# Altium schematic sheet DSO_ADC.SchDoc: Schematic_Name
size A4; CompanyName: University of Melbourne; Engineer: Your Name Here; DocumentNumber: 1; Revision: 0.1; SheetNumber: 1; SheetTotal: 1; Title_Project: Project_Title; StudentNo: Student No.
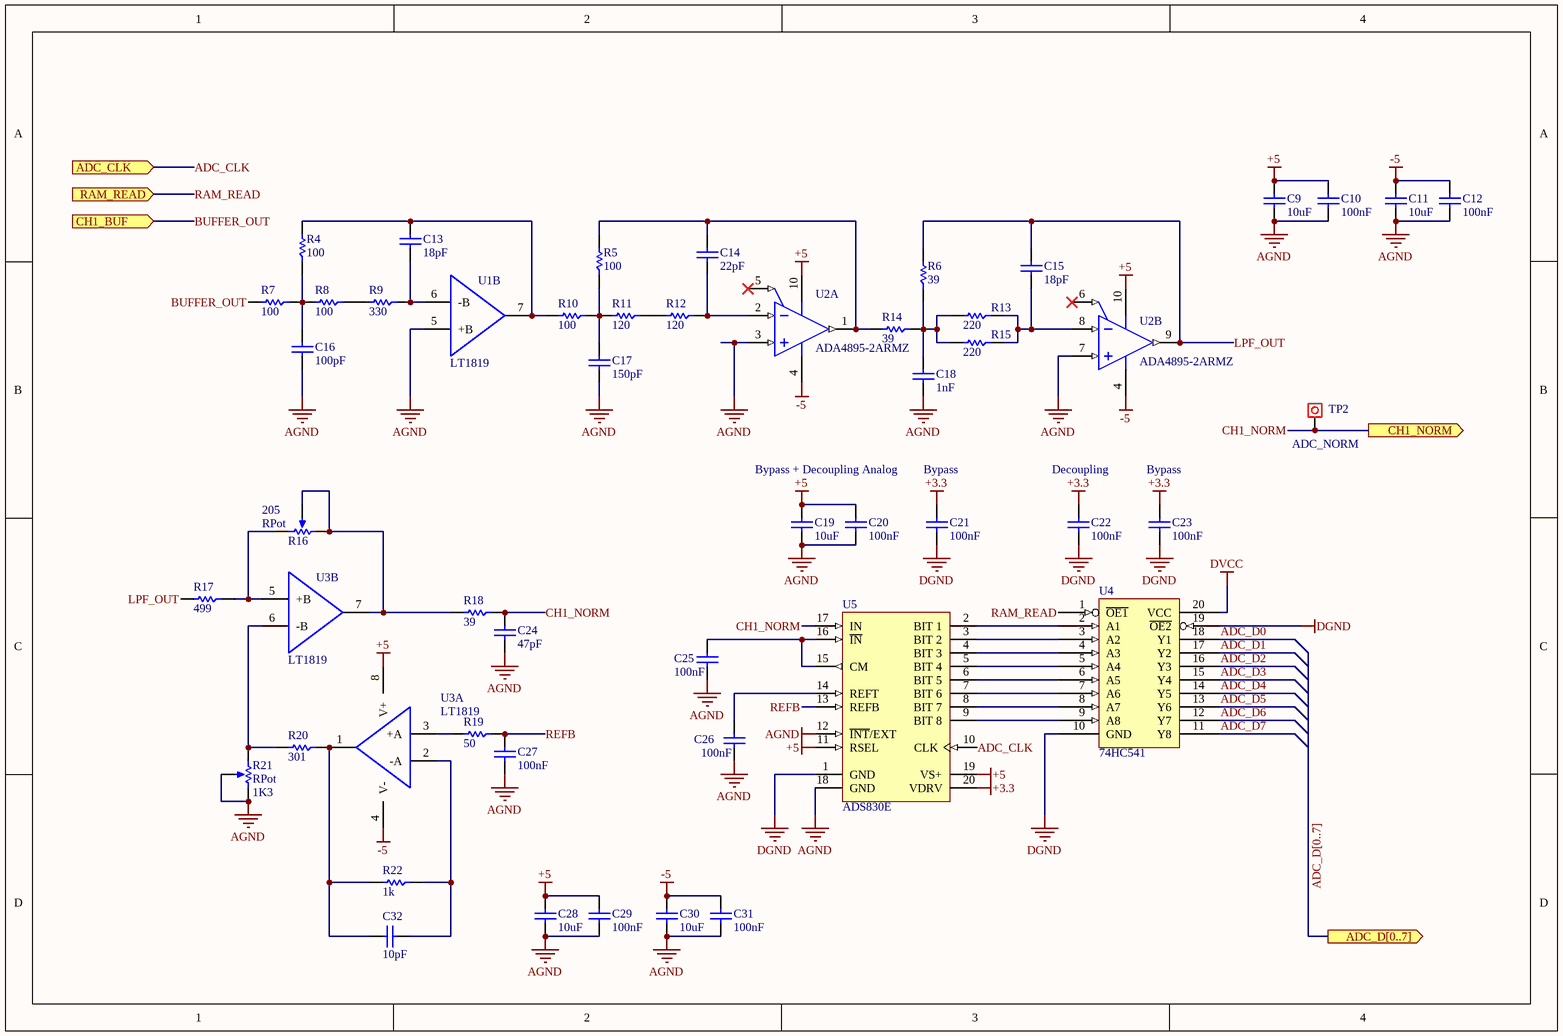
[diagram p0: DSO_ADC.SchDoc]

## Parts
C9  10uF  [0805C]
C10  100nF  [0805C]
C11  10uF  [0805C]
C12  100nF  [0805C]
C13  18pF  [0805C]
C14  22pF  [0805C]
C15  18pF  [0805C]
C16  100pF  [0805C]
C17  150pF  [0805C]
C18  1nF  [0805C]
C19  10uF  [0805C]
C20  100nF  [0805C]
C21  100nF  [0805C]
C22  100nF  [0805C]
C23  100nF  [0805C]
C24  47pF  [0805C]
C25  100nF  [0805C]
C26  100nF  [0805C]
C27  100nF  [0805C]
C28  10uF  [0805C]
C29  100nF  [0805C]
C30  10uF  [0805C]
C31  100nF  [0805C]
C32  10pF  [0805C]
R4  100  [0805]
R5  100  [0805]
R6  39  [0805]
R7  100  [0805]
R8  100  [0805]
R9  330  [0805]
R10  100  [0805]
R11  120  [0805]
R12  120  [0805]
R13  220  [0805]
R14  39  [0805]
R15  220  [0805]
R16  RPot  value 205  [VR5]
R17  499  [0805]
R18  39  [0805]
R19  50  [0805]
R20  301  [0805]
R21  RPot  value 1K3  [VR5]
R22  1k  [0805]
TP2  ADC_NORM  [Testpoin]  (no BOM)
U1  LT1819  [SOIC-8]  (part B of 2)
U2  ADA4895-2ARMZ  [ADI-RM-10_M]  (parts A,B of 2)
U3  LT1819  [SOIC-8]  (parts A,B of 2)
U4  74HC541  [SOT163-1_N]
U5  ADS830E  [TI-DBQ20_L]

## Ports
ADC_CLK (in), ADC_D[0..7] (out), CH1_BUF (in), CH1_NORM (out), RAM_READ (in)

## Nets
+3.3: C21.1 C22.1 C23.1 U5.20(VDRV)
+5: C9.1 C10.1 C19.1 C20.1 C28.1 C29.1 U2.10(+VS) U3.8(V+) U5.11(RSEL) U5.19(VS+)
-5: C11.1 C12.1 C30.1 C31.1 U2.4(-VS) U3.4(V-)
AGND: C9.2 C10.2 C11.2 C12.2 C16.2 C17.2 C18.2 C19.2 C20.2 C24.2 C25.2 C26.2 C27.2 C28.2 C29.2 C30.2 C31.2 R21.2(TAP) R21.3(BOT) U1.5(+B) U2.3(+IN_1) U2.7(+IN_2) U5.12(~{INT}/EXT) U5.18(GND)
DGND: C21.2 C22.2 C23.2 U4.10(GND) U4.19(~{OE2}) U5.1(GND)
DVCC: U4.20(VCC)
ADC_CLK: U5.10(CLK) ; port ADC_CLK
ADC_D0: U4.18(Y1)
ADC_D1: U4.17(Y2)
ADC_D2: U4.16(Y3)
ADC_D3: U4.15(Y4)
ADC_D4: U4.14(Y5)
ADC_D5: U4.13(Y6)
ADC_D6: U4.12(Y7)
ADC_D7: U4.11(Y8)
BUFFER_OUT: R7.2 ; port CH1_BUF
CH1_NORM: C24.1 R18.1 TP2.1 U5.17(IN) ; port CH1_NORM
LPF_OUT: C15.1 R6.2 R17.2 U2.9(OUT_2)
RAM_READ: U4.1(~{OE1}) ; port RAM_READ
REFB: C27.1 R19.1 U5.13(REFB)
NetC13_1: C13.1 R4.2 R10.2 U1.7(OUTB)
NetC13_2: C13.2 R9.1 U1.6(-B)
NetC14_1: C14.1 R5.2 R14.2 U2.1(OUT_1)
NetC14_2: C14.2 R12.1 U2.2(-IN_1)
NetC15_2: C15.2 R13.1 R15.1 U2.8(-IN_2)
NetC16_1: C16.1 R4.1 R7.1 R8.2
NetC17_1: C17.1 R5.1 R10.1 R11.2
NetC18_1: C18.1 R6.1 R13.2 R14.1 R15.2
NetC25_1: C25.1 U5.15(CM) U5.16(~{IN})
NetC26_1: C26.1 U5.14(REFT)
NetC32_1: C32.1 R20.1 R22.2 U3.1(OUTA)
NetC32_2: C32.2 R22.1 U3.2(-A)
NetR8_1: R8.1 R9.2
NetR11_1: R11.1 R12.2
NetR16_1: R16.1(TOP) R16.2(TAP) R18.2 U3.7(OUTB)
NetR16_3: R16.3(BOT) R17.1 U3.5(+B)
NetR19_2: R19.2 U3.3(+A)
NetR20_2: R20.2 R21.1(TOP) U3.6(-B)
NetU4_2: U4.2(A1) U5.2(BIT_1)
NetU4_3: U4.3(A2) U5.3(BIT_2)
NetU4_4: U4.4(A3) U5.4(BIT_3)
NetU4_5: U4.5(A4) U5.5(BIT_4)
NetU4_6: U4.6(A5) U5.6(BIT_5)
NetU4_7: U4.7(A6) U5.7(BIT_6)
NetU4_8: U4.8(A7) U5.8(BIT_7)
NetU4_9: U4.9(A8) U5.9(BIT_8)

Not connected (* = marked no-connect by the designer): U2 5(~{DISABLE1})* 6(~{DISABLE2})*

## Buses and harness runs
bus ADC_D[0..7] = port ADC_D[0..7]

## Notes on the sheet
- Bypass + Decoupling Analog
- (near C21) Bypass
- Decoupling
- (near C23) Bypass

## Library data of the parts
C9-C32 = C: Capacitor; Reviewed by: RM - 2018/08/05; Revision: July-2002: Re-released for DXP Platform.; Supplier 1: *; Supplier Part Number 1: *
  C9 C11 C19 C28 C30: Value: 10uF
  C10 C12 C20-C23 C25-C27 C29 C31: Value: 100nF
  C13 C15: Value: 18pF
  C14: Value: 22pF
  C16: Value: 100pF
  C17: Value: 150pF
  C18: Value: 1nF
  C24: Value: 47pF
  C32: Value: 10pF
R4-R15 R17-R20 R22 = R: Resistor; Reviewed by: RM - 2018/08/05; Supplier 1: *; Suppler Part Number 1: *
  R4 R5 R7 R8 R10: Value: 100
  R6 R14 R18: Value: 39
  R9: Value: 330
  R11 R12: Value: 120
  R13 R15: Value: 220
  R17: Value: 499
  R19: Value: 50
  R20: Value: 301
  R22: Value: 1k
R16 R21 = RPot: Potentiometer; Sim Note: Enter the Resistance value and the set point into parameter fields.; Set Position: 0.5; Published: 8-Jun-2000; LatestRevisionDate: 17-Jul-2002; LatestRevisionNote: Re-released for DXP Platform.; PackageReference: VR5; Publisher: Altium Limited; PackageDescription: Variable Resistor, Thru-Hole; 3 Leads
TP2 = Test Point: Pad; Value: ADC_NORM
U1 U3 = LT1819: OpAmp High Frequency Dual; Reviewed by: RM - 2018/08/05; Supplier 1: Digi-Key; Supplier Part Number 1: LT1819CMS8#PBF-ND
U2 = CMP-0384-01589-1: Double Channel Low Wide Band Noise Operational Amplifier, 236 MHz BW, 943 V/us SR, Industrial, 10-pin SOP (RM-10), Tray; Manufacturer: Analog Devices; Amplifiers Per Package: 2; Small Signal Bandwidth: 236MHz; V Span Min: 3V; Input Offset Voltage: 28uV; Iq/Amp: 3mA; Input Bias Current: 11uA; V Span Max: 10V; ComponentLink1Description: Manufacturer URL; ComponentLink3Description: Package Specification; ComponentLink3URL: http://www.analog.com/static/imported-files/packages/PKG_PDF/MSOP%28RM%29/RM_10.pdf; Code_JEDEC: MO-187-BA; Slew Rate: 943V/us; ComponentLink2Description: Datasheet; Generic Part Number: ADA4895-2; PackageReference: RM-10; ComponentLink2URL: http://www.analog.com/static/imported-files/data_sheets/ADA4895-2.PDF; Mounting Technology: Surface Mount; DatasheetVersion: Rev. 0; PartNumber: ADA4895-2ARMZ; ComponentLink1URL: http://www.analog.com/en/index.html; Packing: Tray; PackageDescription: 10-Pin Mini Small Outline Package, Body 3 x 3 mm, Pitch 0.5 mm
U4 = 74HC541: (ADV) Octal Buffer, Line Driver; Reviewed by: RM - 2018/08/05; Supplier 1: Digi-Key; Supplier Part Number 1: 296-1202-1-ND
U5 = ADS830E: 8-Bit, 60 MSPS ADC Single-Ended / Differential Input, Internal / External Reference and Programmble Input Range, -40 to 85 degC, 20-pin SOP (DBQ20), Green (RoHS & no Sb/Br); Reviewed by: RM - 2018/08/05; ComponentLink2URL: http://www.ti.com/general/docs/lit/getliterature.tsp?genericPartNumber=ADS830&fileType=pdf; ComponentLink2Description: Datasheet; ComponentLink1URL: http://www.ti.com/; ComponentLink3URL: http://www.ti.com/litv/pdf/mpds210a; ComponentLink3Description: Package Specification; ComponentLink1Description: Manufacturer URL; Supplier 1: Digi-Key; Supplier Part Number 1: ADS830E-ND